# EAGLE design shield (EAGLE 6.2)
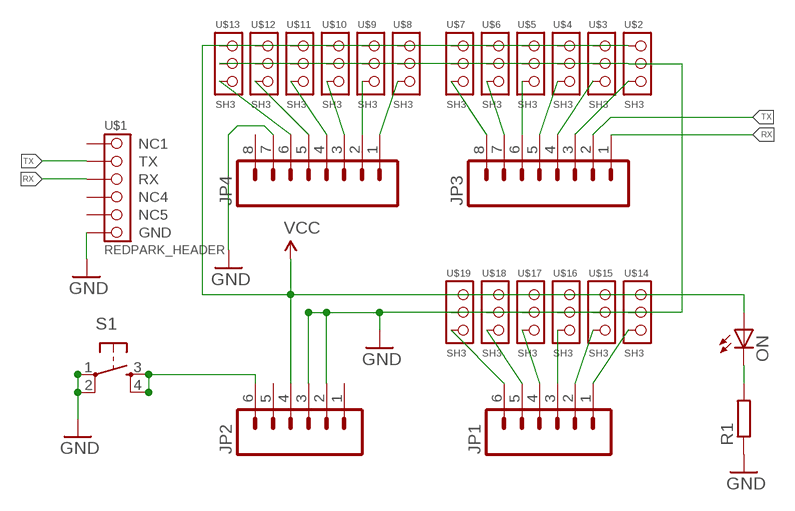
[diagram p0: schematic, sheet 1]

## Parts
JP1  M06SIP  [1X06]
JP2  M06SIP  [1X06]
JP3  M081X08  [1X08]
JP4  M081X08  [1X08]
ON  LEDCHIP-LED0805  [CHIP-LED0805]
R1  R-EU_M0805  [M0805]
S1  TAC_SWITCHPTH  [TACTILE-PTH]
U$1  REDPARK_HEADER  [REDPARK_HEADER]
U$2  SH3  [SH3]
U$3  SH3  [SH3]
U$4  SH3  [SH3]
U$5  SH3  [SH3]
U$6  SH3  [SH3]
U$7  SH3  [SH3]
U$8  SH3  [SH3]
U$9  SH3  [SH3]
U$10  SH3  [SH3]
U$11  SH3  [SH3]
U$12  SH3  [SH3]
U$13  SH3  [SH3]
U$14  SH3  [SH3]
U$15  SH3  [SH3]
U$16  SH3  [SH3]
U$17  SH3  [SH3]
U$18  SH3  [SH3]
U$19  SH3  [SH3]

## Nets
A0: JP1.6 U$19.+
A1: JP1.5 U$18.+
A2: JP1.4 U$17.+
A3: JP1.3 U$16.+
A4: JP1.2 U$15.+
A5: JP1.1 U$14.+
GND: JP2.2 JP2.3 JP4.7 R1.1 S1.1 S1.2 U$1.6(GND) U$2.- U$3.- U$4.- U$5.- U$6.- U$7.- U$8.- U$9.- U$10.- U$11.- U$12.- U$13.- U$14.- U$15.- U$16.- U$17.- U$18.- U$19.-
IO2: JP3.3 U$2.+
IO3: JP3.4 U$3.+
IO4: JP3.5 U$4.+
IO5: JP3.6 U$5.+
IO6: JP3.7 U$6.+
IO7: JP3.8 U$7.+
IO8: JP4.1 U$8.+
IO9: JP4.2 U$9.+
IO10: JP4.3 U$10.+
IO11: JP4.4 U$11.+
IO12: JP4.5 U$12.+
IO13: JP4.6 U$13.+
N$1: JP2.6 S1.3 S1.4
N$3: ON.C R1.2
RX: JP3.1 U$1.3(RX)
TX: JP3.2 U$1.2(TX)
VCC: JP2.4 ON.A U$2.S U$3.S U$4.S U$5.S U$6.S U$7.S U$8.S U$9.S U$10.S U$11.S U$12.S U$13.S U$14.S U$15.S U$16.S U$17.S U$18.S U$19.S
Unconnected: JP2.1 JP2.5 JP4.8 U$1.1(NC1) U$1.4(NC4) U$1.5(NC5)

## Library data of the parts
JP1 JP2 = SparkFun:M06: Header 6 Standard 6-pin 0.1" header. Use with straight break away headers (SKU : PRT-00116), right angle break away headers (PRT-00553), swiss pins (PRT-00743), machine pins (PRT-00117), and female headers (PRT-00115). Molex polarized connector foot print use with SKU : PRT-08094 with associated crimp pins and housings. NOTES ON THE VARIANTS LOCK and LOCK_LONGPADS... This footprint was designed to help hold the alignment of a through-hole component (i.e. 6-pin header) while soldering it into place. You may notice that each hole has been shifted either up or down by 0.005 of an inch from it's more standard position (which is a perfectly straight line). This slight alteration caused the pins (the squares in the middle) to touch the edges of the holes. Because they are alternating, it causes a "brace" to hold the component in place. 0.005 has proven to be the perfect amount of "off-center" position when using our standard breakaway headers. Although looks a little odd when you look at the bare footprint, once you have a header in there, the alteration is very hard to notice. Also, if you push a header all the way into place, it is covered up entirely on the bottom side. This idea of altering the position of holes to aid alignment will be further integrated into the Sparkfun Library for other footprints. It can help hold any component with 3 or more connection pins.
JP3 JP4 = SparkFun:M08: Header 8 Standard 8-pin 0.1" header. Use with straight break away headers (SKU : PRT-00116), right angle break away headers (PRT-00553), swiss pins (PRT-00743), machine pins (PRT-00117), and female headers (PRT-00115).
ON = led:LED: LED OSRAM: - CHIPLED LG R971, LG N971, LY N971, LG Q971, LY Q971, LO R971, LY R971 LH N974, LH R974 LS Q976, LO Q976, LY Q976 LO Q996 - Hyper CHIPLED LW Q18S LB Q993, LB Q99A, LB R99A - SideLED LS A670, LO A670, LY A670, LG A670, LP A670 LB A673, LV A673, LT A673, LW A673 LH A674 LY A675 LS A676, LA A676, LO A676, LY A676, LW A676 LS A679, LY A679, LG A679 - Hyper Micro SIDELED® LS Y876, LA Y876, LO Y876, LY Y876 LT Y87S - SmartLED LW L88C, LW L88S LB L89C, LB L89S, LG L890 LS L89K, LO L89K, LY L89K LS L896, LA L896, LO L896, LY L896 - TOPLED LS T670, LO T670, LY T670, LG T670, LP T670 LSG T670, LSP T670, LSY T670, LOP T670, LYG T670 LG T671, LOG T671, LSG T671 LB T673, LV T673, LT T673, LW T673 LH T674 LS T676, LA T676, LO T676, LY T676, LB T676, LH T676, LSB T676, LW T676 LB T67C, LV T67C, LT T67C, LS T67K, LO T67K, LY T67K, LW E67C LS E67B, LA E67B, LO E67B, LY E67B, LB E67C, LV E67C, LT E67C LW T67C LS T679, LY T679, LG T679 LS T770, LO T770, LY T770, LG T770, LP T770 LB T773, LV T773, LT T773, LW T773 LH T774 LS E675, LA E675, LY E675, LS T675 LS T776, LA T776, LO T776, LY T776, LB T776 LHGB T686 LT T68C, LB T68C - Hyper Mini TOPLED® LB M676 - Mini TOPLED Santana® LG M470 LS M47K, LO M47K, LY M47K Source: http://www.osram.convergy.de LUXEON: - LUMILED® LXK2-PW12-R00, LXK2-PW12-S00, LXK2-PW14-U00, LXK2-PW14-V00 LXK2-PM12-R00, LXK2-PM12-S00, LXK2-PM14-U00 LXK2-PE12-Q00, LXK2-PE12-R00, LXK2-PE12-S00, LXK2-PE14-T00, LXK2-PE14-U00 LXK2-PB12-K00, LXK2-PB12-L00, LXK2-PB12-M00, LXK2-PB14-N00, LXK2-PB14-P00, LXK2-PB14-Q00 LXK2-PR12-L00, LXK2-PR12-M00, LXK2-PR14-Q00, LXK2-PR14-R00 LXK2-PD12-Q00, LXK2-PD12-R00, LXK2-PD12-S00 LXK2-PH12-R00, LXK2-PH12-S00 LXK2-PL12-P00, LXK2-PL12-Q00, LXK2-PL12-R00 Source: www.luxeon.com KINGBRIGHT: KA-3528ASYC Source: www.kingbright.com
R1 = rcl:R-EU_: RESISTOR, European symbol
S1 = SparkFun:TAC_SWITCH: Momentary Switch Button commonly used for reset or general input. Spark Fun Electronics SKU : COM-00097
U$1 = appessory:REDPARK_HEADER
U$2-U$19 = appessory:SH3

## Board
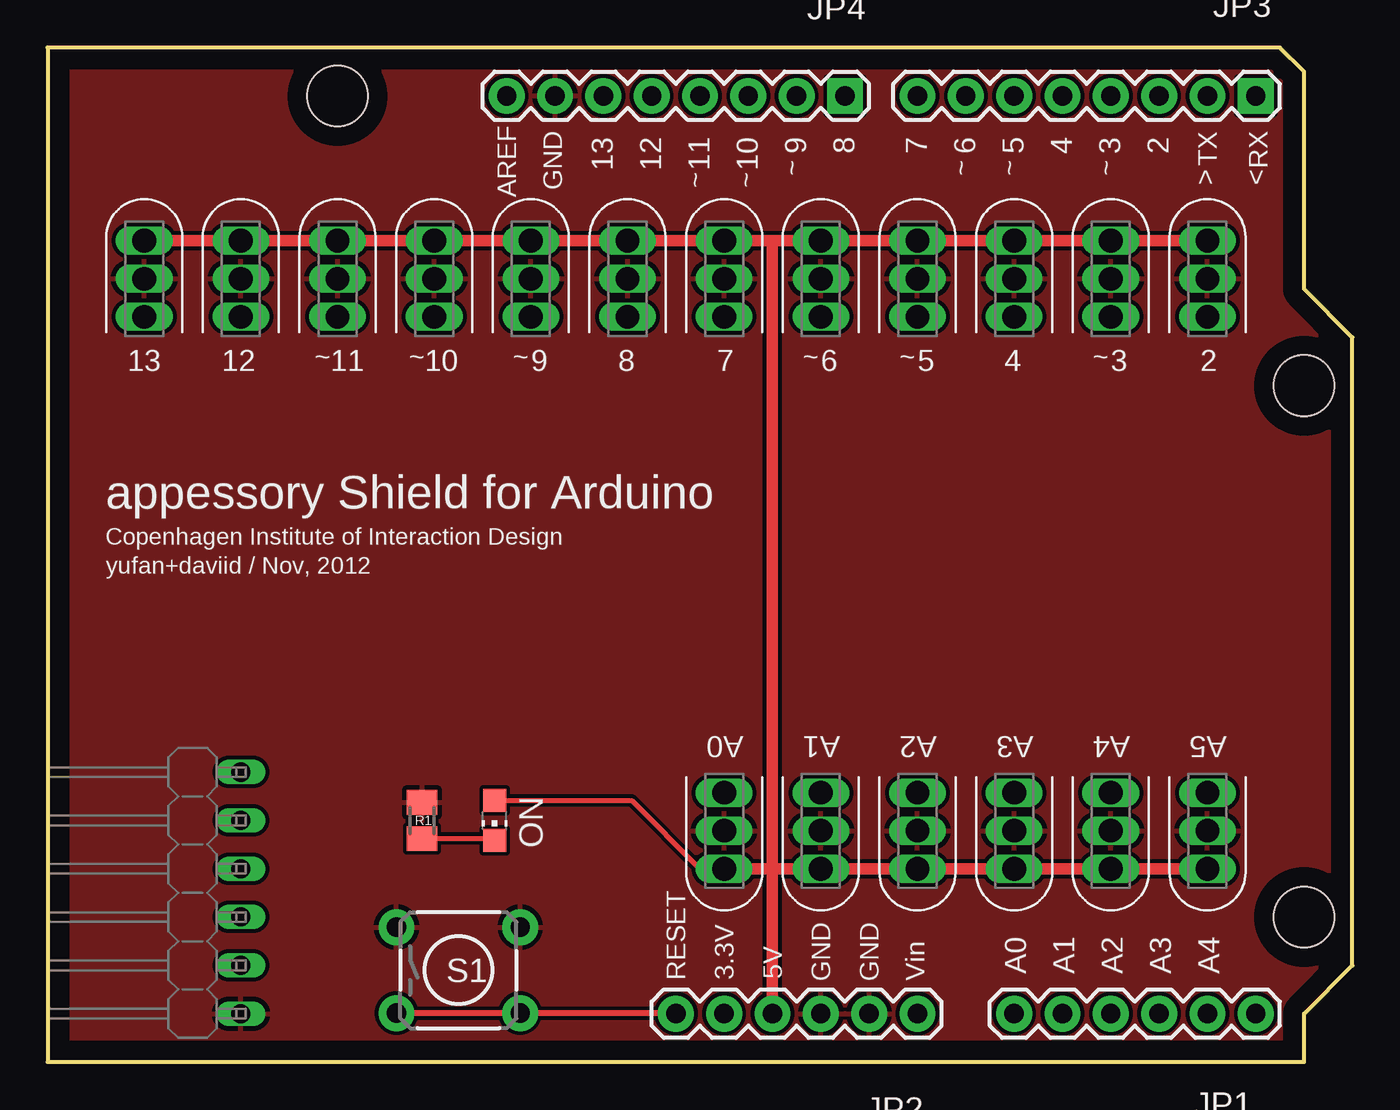
[diagram p1: board, top side]
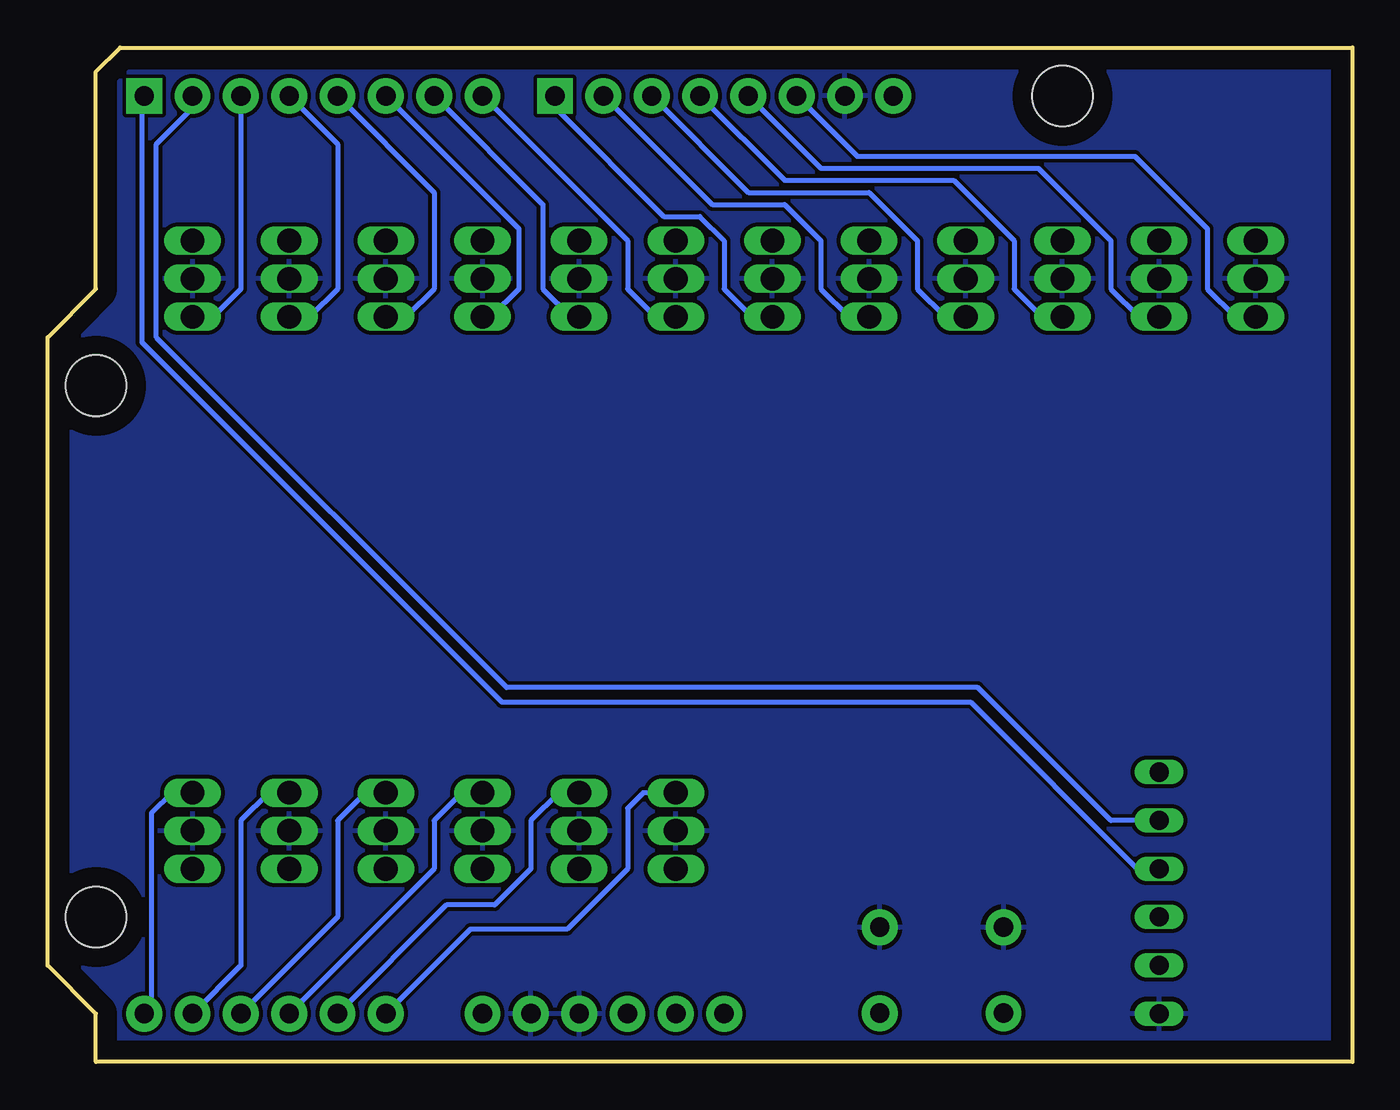
[diagram p2: board, bottom side, seen from below]

Size 68.58 x 53.34 mm. Coordinates in mm from the lower left corner, seen from the top.
Copper layers (1*16): Top 0.035mm / dielectric 1.5mm / Bottom 0.035mm
Design rules: minimum track width 10mil, minimum drill 24mil, track to track 8mil, track to pad 8mil, pad to pad 8mil, via to via 8mil, smd to smd 8mil, copper to edge 40mil, drill to drill 8mil, minimum pad ring 5mil, minimum via ring 8mil, stop-mask expansion 4mil, vias tented up to drill 0mil, thermal gap 10mil

### Footprints (pad centres in the part's own frame; a part is rotated, then mirrored left to right if it is on the bottom)
1X06 = drill 1.016 pad 1.88: 1 0,0; 2 2.54,0; 3 5.08,0; 4 7.62,0; 5 10.16,0; 6 12.7,0
1X08 = drill 1.016 pad 1.88 square: 1 0,0 | drill 1.016 pad 1.88: 2 2.54,0; 3 5.08,0; 4 7.62,0; 5 10.16,0; 6 12.7,0; 7 15.24,0; 8 17.78,0
CHIP-LED0805 = smd 1.2 x 1.2: A 0,-1.05; C 0,1.05
M0805 = smd 1.3 x 1.6: 1 -0.95,0; 2 0.95,0
TACTILE-PTH = drill 1.016 pad 1.88: 1 -3.251,2.261; 2 3.251,2.261; 3 -3.251,-2.261; 4 3.251,-2.261
REDPARK_HEADER = drill 1 pad 1.3 long: 1 0,6.35; 2 0,3.81; 3 0,1.27; 4 0,-1.27; 5 0,-3.81; 6 0,-6.35
SH3 = drill 1.25 pad 1.5 long: + 0,-4; - 0,-2; S 0,0
ARDUINO-OUTLINE = hole 3.2: 15.24,50.8; 66.04,35.56; 66.04,7.62

### Placement (x,y rotation side)
JP1  63.5,2.54 180 top
JP2  45.72,2.54 180 top
JP3  63.5,50.8 180 top
JP4  41.91,50.8 180 top
ON  23.5,12.7 180 top
R1  19.68,12.7 270 top
S1  21.59,4.83 0 top
U$1  10.16,8.89 0 top
U$2  60.96,43.18 0 top
U$3  55.88,43.18 0 top
U$4  50.8,43.18 0 top
U$5  45.72,43.18 0 top
U$6  40.64,43.18 0 top
U$7  35.56,43.18 0 top
U$8  30.48,43.18 0 top
U$9  25.4,43.18 0 top
U$10  20.32,43.18 0 top
U$11  15.24,43.18 0 top
U$12  10.16,43.18 0 top
U$13  5.08,43.18 0 top
U$14  60.96,10.16 180 top
U$15  55.88,10.16 180 top
U$16  50.8,10.16 180 top
U$17  45.72,10.16 180 top
U$18  40.64,10.16 180 top
U$19  35.56,10.16 180 top
U$20  [ARDUINO-OUTLINE]  0,0 0 top
U$21  [CONNECTOR_OUTLINE]  60.96,39.37 0 top
U$22  [CONNECTOR_OUTLINE]  55.88,39.37 0 top
U$23  [CONNECTOR_OUTLINE]  50.8,39.37 0 top
U$24  [CONNECTOR_OUTLINE]  45.72,39.37 0 top
U$25  [CONNECTOR_OUTLINE]  40.64,39.37 0 top
U$26  [CONNECTOR_OUTLINE]  35.56,39.37 0 top
U$27  [CONNECTOR_OUTLINE]  30.48,39.37 0 top
U$28  [CONNECTOR_OUTLINE]  25.4,39.37 0 top
U$29  [CONNECTOR_OUTLINE]  20.32,39.37 0 top
U$30  [CONNECTOR_OUTLINE]  15.24,39.37 0 top
U$31  [CONNECTOR_OUTLINE]  10.16,39.37 0 top
U$32  [CONNECTOR_OUTLINE]  5.08,39.37 0 top
U$33  [CONNECTOR_OUTLINE]  60.96,13.97 180 top
U$34  [CONNECTOR_OUTLINE]  55.88,13.97 180 top
U$35  [CONNECTOR_OUTLINE]  50.8,13.97 180 top
U$36  [CONNECTOR_OUTLINE]  45.72,13.97 180 top
U$37  [CONNECTOR_OUTLINE]  40.64,13.97 180 top
U$38  [CONNECTOR_OUTLINE]  35.56,13.97 180 top

### Tracks (layer width: path | path; a pad name or v marks a point on that pad's centre or on a via)
A0
  Bottom 0.254: U$19.+ 37.27,14.16 38.1,13.34 38.1,10.16 41.27,6.99 46.35,6.99 JP1.6
A1
  Bottom 0.254: U$18.+ 41.72,14.16 43.18,12.7 43.18,10.16 45.09,8.26 47.62,8.26 JP1.5
A2
  Bottom 0.254: U$17.+ 46.8,14.16 48.26,12.7 48.26,10.16 JP1.4
A3
  Bottom 0.254: U$16.+ 51.88,14.16 53.34,12.7 53.34,7.62 JP1.3
A4
  Bottom 0.254: U$15.+ 56.96,14.16 58.42,12.7 58.42,5.08 JP1.2
A5
  Bottom 0.254: U$14.+ 62.04,14.16 63.12,13.08 63.12,2.92 JP1.1
GND
  pour Top: 0.64,52.7 67.94,52.7 67.94,0.64 0.64,0.64
  pour Bottom: 0.64,52.7 67.94,52.7 67.94,0.64 0.64,0.64
IO2
  Bottom 0.254: JP3.3 58.42,40.64 59.88,39.18 U$2.+
IO3
  Bottom 0.254: JP3.4 53.34,48.26 53.34,40.64 54.8,39.18 U$3.+
IO4
  Bottom 0.254: JP3.5 48.26,45.72 48.26,40.64 49.72,39.18 U$4.+
IO5
  Bottom 0.254: JP3.6 43.81,43.81 43.81,40.64 45.27,39.18 U$5.+
IO6
  Bottom 0.254: JP3.7 42.55,45.09 42.55,40.64 41.09,39.18 U$6.+
IO7
  Bottom 0.254: JP3.8 38.1,43.18 38.1,40.64 36.64,39.18 U$7.+
IO8
  Bottom 0.254: U$8.+ 31.56,39.18 33.02,40.64 33.02,43.18 34.29,44.45 36.2,44.45 41.91,50.16 JP4.1
IO9
  Bottom 0.254: U$9.+ 26.48,39.18 27.94,40.64 27.94,43.18 29.84,45.09 33.66,45.09 JP4.2
IO10
  Bottom 0.254: U$10.+ 21.4,39.18 22.86,40.64 22.86,43.18 25.4,45.72 31.75,45.72 JP4.3
IO11
  Bottom 0.254: JP4.4 29.84,46.35 20.95,46.35 17.78,43.18 17.78,40.64 16.32,39.18 U$11.+
IO12
  Bottom 0.254: U$12.+ 11.24,39.18 12.7,40.64 12.7,43.18 16.51,46.99 27.94,46.99 JP4.5
IO13
  Bottom 0.254: U$13.+ 6.16,39.18 7.62,40.64 7.62,43.81 11.43,47.62 26.04,47.62 JP4.6
N$1
  Top 0.254: 32.99,2.56 JP2.6
  Top 0.305: 32.99,2.56 S1.4 S1.3
N$3
  Top 0.254: R1.2 23.5,11.75 ON.C
RX
  Bottom 0.254: JP3.1 63.63,50.67 63.63,37.85 44.7,18.92 20.07,18.92 11.3,10.16 U$1.3
TX
  Bottom 0.254: U$1.2 12.7,12.7 19.68,19.68 44.45,19.68 62.87,38.1 62.87,48.26 60.96,50.16 JP3.2
VCC
  Top 0.254: ON.A 30.7,13.75 34.29,10.16 U$19.S
  Top 0.61: U$19.S 38.1,10.16 | 38.1,10.16 U$18.S U$17.S U$16.S U$15.S U$14.S | 38.1,43.18 U$6.S U$5.S U$4.S U$3.S U$2.S | 38.1,43.18 38.1,10.16 | U$12.S U$13.S U$11.S U$10.S U$9.S U$8.S U$7.S 38.1,43.18 | 38.1,10.16 JP2.4

### Text on the board
tPlace: 9 | 8 | 7 | 6 | 5 | 4 | 3 | 2 | 13 | 12 | 11 | 10 | ~ | ~ | ~ | ~ | TX | RX | GND | ~ | ~ | > | < | AREF | ~ | ~ | ~ | ~ | ~ | ~ | 13 | 12 | 11 | 10 | 9 | 8 | 7 | 6 | 5 | 4 | 3 | 2 | appessory Shield for Arduino | Copenhagen Institute of Interaction Design | yufan+daviid / Nov, 2012 | A0 | A1 | A2 | A3 | A4 | A5 | RESET | 3.3V | GND | GND | A0 | A1 | A2 | A3 | A4 | 5V | Vin